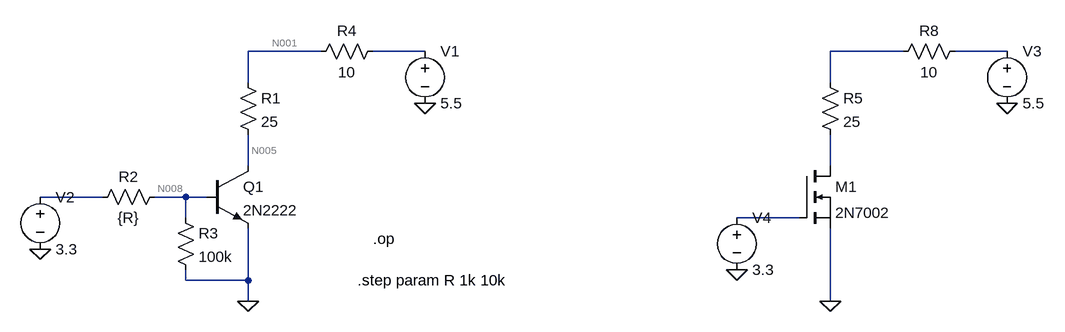
[diagram p0: schematic Draft2.asc]
Draft2.asc, the LTspice schematic file:
Version 4
SHEET 1 1556 680
WIRE 352 -80 240 -80
WIRE 512 -80 432 -80
WIRE 1248 -80 1136 -80
WIRE 1408 -80 1328 -80
WIRE 240 -32 240 -80
WIRE 1136 -32 1136 -80
WIRE 240 96 240 48
WIRE 1136 96 1136 48
WIRE 16 144 -80 144
WIRE 144 144 96 144
WIRE 176 144 144 144
WIRE 144 176 144 144
WIRE 1088 176 992 176
WIRE 144 272 144 256
WIRE 240 272 240 192
WIRE 240 272 144 272
WIRE 240 304 240 272
WIRE 1136 304 1136 192
FLAG 512 0 0
FLAG 240 304 0
FLAG -80 224 0
FLAG 1408 0 0
FLAG 1136 304 0
FLAG 992 256 0
SYMBOL npn 176 96 R0
SYMATTR InstName Q1
SYMATTR Value 2N2222
SYMBOL res 224 -48 R0
SYMATTR InstName R1
SYMATTR Value 25
SYMBOL voltage 512 -96 R0
WINDOW 123 0 0 Left 0
WINDOW 39 0 0 Left 0
SYMATTR InstName V1
SYMATTR Value 5.5
SYMBOL voltage -80 128 R0
WINDOW 123 0 0 Left 0
WINDOW 39 0 0 Left 0
SYMATTR InstName V2
SYMATTR Value 3.3
SYMBOL res 112 128 R90
WINDOW 0 0 56 VBottom 2
WINDOW 3 32 56 VTop 2
SYMATTR InstName R2
SYMATTR Value {R}
SYMBOL res 128 160 R0
SYMATTR InstName R3
SYMATTR Value 100k
SYMBOL res 448 -96 R90
WINDOW 0 0 56 VBottom 2
WINDOW 3 32 56 VTop 2
SYMATTR InstName R4
SYMATTR Value 10
SYMBOL res 1120 -48 R0
SYMATTR InstName R5
SYMATTR Value 25
SYMBOL voltage 1408 -96 R0
WINDOW 123 0 0 Left 0
WINDOW 39 0 0 Left 0
SYMATTR InstName V3
SYMATTR Value 5.5
SYMBOL voltage 992 160 R0
WINDOW 123 0 0 Left 0
WINDOW 39 0 0 Left 0
SYMATTR InstName V4
SYMATTR Value 3.3
SYMBOL res 1344 -96 R90
WINDOW 0 0 56 VBottom 2
WINDOW 3 32 56 VTop 2
SYMATTR InstName R8
SYMATTR Value 10
SYMBOL nmos 1088 96 R0
SYMATTR InstName M1
SYMATTR Value 2N7002
TEXT 432 208 Left 2 !.op
TEXT 408 272 Left 2 !.step param R 1k 10k

The netlist it stands for:
* Draft2.asc
Q1 N005 N008 0 0 2N2222
R1 N001 N005 25
V1 N002 0 5.5
V2 N007 0 3.3
R2 N008 N007 {R}
R3 N008 0 100k
R4 N002 N001 10
R5 N003 N006 25
V3 N004 0 5.5
V4 N009 0 3.3
R8 N004 N003 10
M1 N006 N009 0 0 2N7002
.model NPN NPN
.model PNP PNP
.lib standard.bjt
.model NMOS NMOS
.model PMOS PMOS
.lib standard.mos
.op
.step param R 1k 10k
.backanno
.end

* Results of the author's LTspice run, read from the files saved beside the schematic
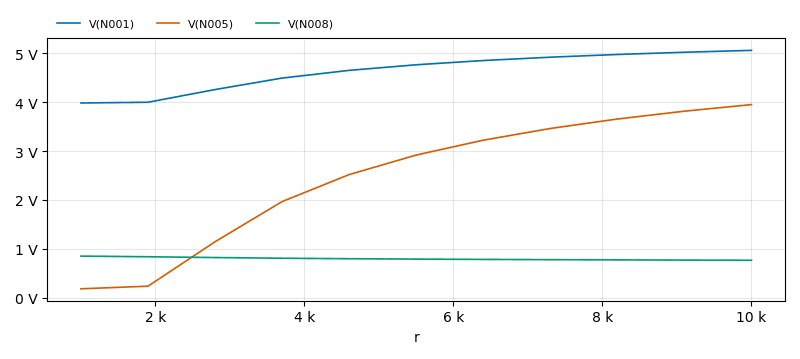
[diagram p1: Operating Point of Draft2.asc, plotted from the saved traces]
* Operating Point, 1 run:
*   V(N001): 3.981 V at r=1 k, 5.057 V at r=10 k, min 3.981 V, max 5.057 V
*   V(N005): 183.9 mV at r=1 k, 3.948 V at r=10 k, min 183.9 mV, max 3.948 V
*   V(N008): 852 mV at r=1 k, 767.2 mV at r=10 k, min 767.2 mV, max 852 mV
* From the log:
*   Semiconductor Device Operating Points:
*                           --- Bipolar Transistors ---
*   Name:       q1
*   Model:    2n2222
*   Ib:       2.44e-03
*   Ic:       1.52e-01
*   Vbe:      8.52e-01
*   Vbc:      6.68e-01
*   Vce:      1.84e-01
*   BetaDC:   6.23e+01
*   Gm:       4.41e+00
*   Rpi:      2.17e+01
*   Rx:       1.00e+01
*   Ro:       1.04e+01
*   Cbe:      2.64e-09
*   Cbc:      1.45e-08
*   Cjs:      0.00e+00
*   BetaAC:   9.56e+01
*   Cbx:      0.00e+00
*   Ft:       4.10e+07
*                           --- VDMOSFET Transistors ---
*   Name:          m1
*   Model:       2n7002
*   Id:          1.39e-01
*   Vgs:         3.30e+00
*   Vds:         6.20e-01
*   Vth:         1.60e+00
*   Gm:          1.09e-01
*   Gds:         2.02e-01
*   Cgs:         5.00e-11
*   Cgd:         7.98e-11
*   Cbody:       3.93e-11